# Altium schematic sheet SMPS 1000mA - LM22672.SchDoc: SMPS power supply (500mA)
size A4; SheetTotal: 10
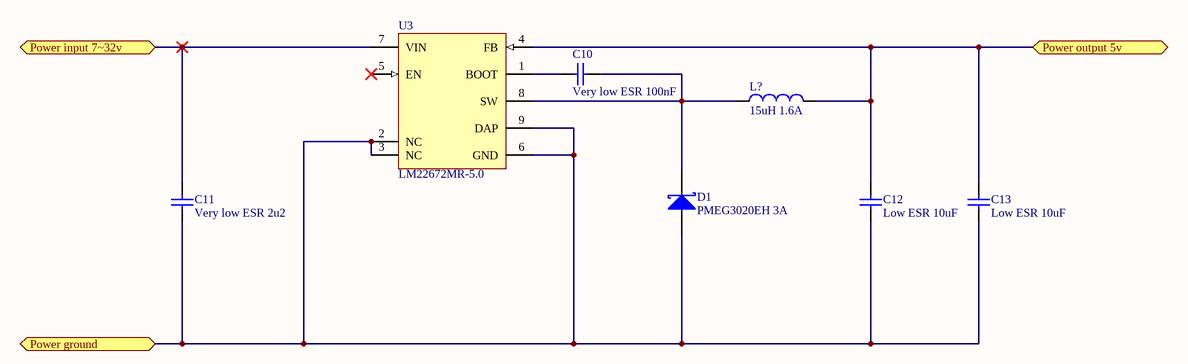
[diagram p0: SMPS 1000mA - LM22672.SchDoc]

## Parts
C10  Very low ESR 100nF  [C0805]
C11  Very low ESR 2u2  [C1210]
C12  Low ESR 10uF  [C1210]
C13  Low ESR 10uF  [C1210]
D1  PMEG3020EH 3A  [SOD123F]
L?  value 15uH 1.6A  [Square_7.3x7.3x4.5]  (hidden comment: inductor)
U3  LM22672MR-5.0  [MRA08B_N]

## Ports
Power ground, Power input 7~32v, Power output 5v

## Nets
Power ground: C11.1 C12.1 C13.1 D1.1 U3.2(NC) U3.3(NC) U3.6(GND) U3.9(DAP) ; port Power ground
Power input 7~32v: C11.2 U3.7(VIN) ; port Power input 7~32v
Power output 5v: C12.2 C13.2 L?.2 U3.4(FB) ; port Power output 5v
NetC10_1: C10.1 U3.1(BOOT)
NetC10_2: C10.2 D1.2 L?.1 U3.8(SW)

Not connected (* = marked no-connect by the designer): U3 5(EN)*

## Notes on the sheet
- Title
- Size:
- Date:
- A4
- Name:
- Time:
- Ing. W. Pietersz
- Revision:
- Sheet
- of
- WillyPietersz@gmail.com
- Contact:
- info@unique-system.nl
- Unique System Elektronics
- Biesboschhaven noord 1-b
- 4251 NL Werkendam
- Netherlands
- www.unique-system.nl
- File:

## Library data of the parts
C10 = 0.01uF-0805-X7R: Voltage: 50V; Type: X7R; Tolerance: 0.1; Part Number: 0.01uF-0805-X7R; Value: 0.01uF-0805-X7R; Package: 0805; Component Type: Low ESR; LatestRevision Date: 14-9-2010; Author: Willem Pietersz; Supplier 2: Farnell; Supplier Part Number 2: 1692287
C11 = 2.2uF-1210-X7R: Voltage: 50V; Type: X7R; Tolerance: 0.1; Part Number: 2.2uF-1210-X7R; Value: 2.2uF-1210-X7R; Package: 1210; Component Type: Low ESR; LatestRevision Date: 14-9-2010; Author: Willem Pietersz; Supplier 2: Farnell; Supplier Part Number 2: 1414066
C12 C13 = 10uF-1210-X5R: Voltage: 10V; Type: X5R; Tolerance: 0.1; Part Number: 10uF-1210-X5R; Value: 10uF-1210-X5R; Package: 1210; Component Type: Low ESR; LatestRevision Date: 14-9-2010; Author: Willem Pietersz; Supplier 2: Farnell; Supplier Part Number 2: 1759458
D1 = PMEG3020EH: Voltage: 30V; Current: 2A; Part Number: PMEG3020EH; Type: Schottky; Component Type: Standard; Supplier 2: Farnell; Supplier Part Number 2: 1510687; ComponentLink2Description: Datasheet; ComponentLink2URL: http://www.nxp.com/documents/data_sheet/PMEG3020EH_EJ.pdf
L? = 15uH-Shield-1.6A-Wurth: Type: Shielded; Part Number: 15uH-Shield-1.6A-Wurth; Supplier 2: Farnell; Supplier Part Number 2: 1635989; ComponentLink2Description: Datasheet; ComponentLink2URL: http://www.farnell.com/datasheets/69698.pdf
U3 = LM22674MR-5.0: Power, 500mA SIMPLE SWITCHER, Step-Down Voltage Regulator with Precision Enable; Manufacturer: National Semiconductor; PackageTopMarking: NSXYTT*L22674*5.0; PowerWise: N; FirstPublished: 4-Dec-2008; DatasheetVersion: Oct-2008; PackageVersion: revB, Dec-2007; PackageReference: MRA08B; Publisher: Altium Limited; PackageDescription: Molded, PSOP .193 x .154 x .058in, 8 Lead, .050in Pitch, Large DAP; CompType: Switcher; PartNumber: LM22674MR-5.0; RoHS: Y; PinCount: 8; DigiKeyPartNumber: LM22674MR-5.0-ND; Code_JEDEC: MS-012-AA; ComponentLink1Description: LM22674 Datasheet; ComponentLink1URL: http://www.national.com/ds/LM/LM22674.pdf; ComponentLink2Description: LM22674 Web Page; ComponentLink2URL: http://www.national.com/pf/LM/LM22674.html; ComponentLink3Description: MRA08B Package Drawing; ComponentLink3URL: http://www.national.com/packaging/folders/mra08b.html